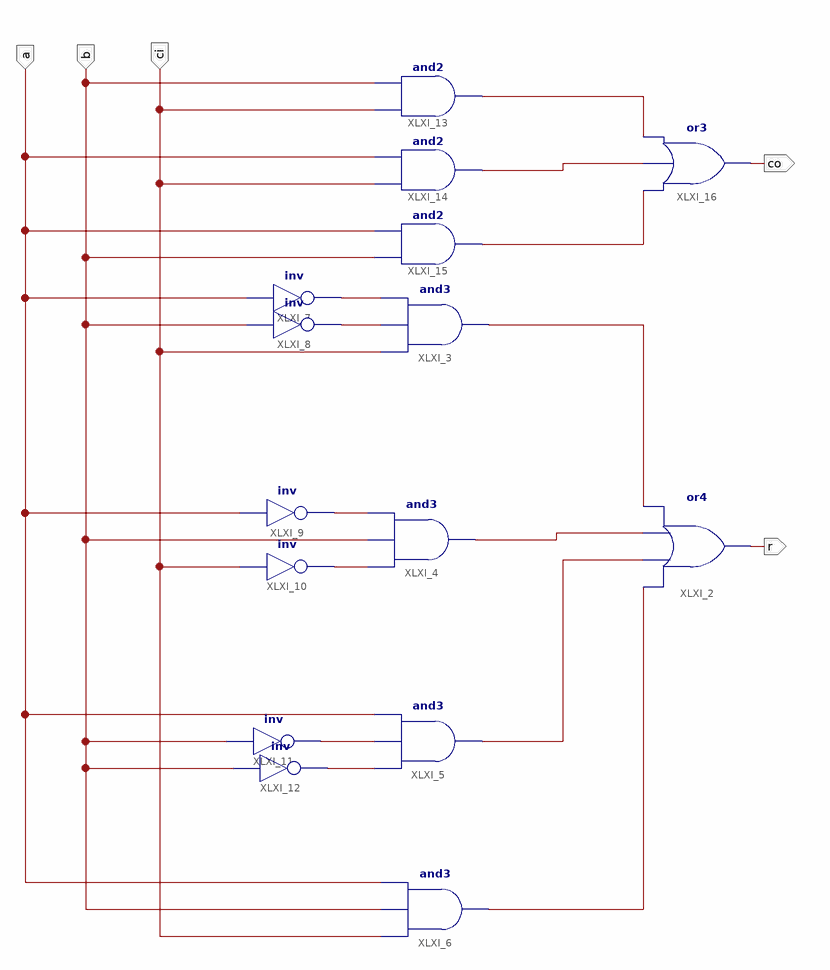
[diagram p0: schematic sheet 1]
// Xilinx ISE schematic add1b.sch (spartan3e) as structural Verilog: 15 symbols, 5 ports
module add1b (
  input  ci,
  input  b,
  input  a,
  output r,
  output co
);

  wire XLXN_2, XLXN_3, XLXN_4, XLXN_9, XLXN_10, XLXN_11, XLXN_12, XLXN_15, XLXN_16, XLXN_17, XLXN_18,
       XLXN_19, XLXN_20;

  or XLXI_2 (r, XLXN_4, XLXN_3, XLXN_2, XLXN_20);
  and XLXI_3 (XLXN_20, ci, XLXN_10, XLXN_9);
  and XLXI_4 (XLXN_2, XLXN_12, b, XLXN_11);
  and XLXI_6 (XLXN_4, ci, b, a);
  not XLXI_7 (XLXN_9, a);
  not XLXI_8 (XLXN_10, b);
  not XLXI_9 (XLXN_11, a);
  not XLXI_10 (XLXN_12, ci);
  not XLXI_11 (XLXN_15, b);
  not XLXI_12 (XLXN_16, b);
  and XLXI_5 (XLXN_3, XLXN_16, XLXN_15, a);
  and XLXI_13 (XLXN_17, ci, b);
  and XLXI_14 (XLXN_18, ci, a);
  and XLXI_15 (XLXN_19, b, a);
  or XLXI_16 (co, XLXN_19, XLXN_18, XLXN_17);
endmodule
